# Altium project grad_board.PrjPcb
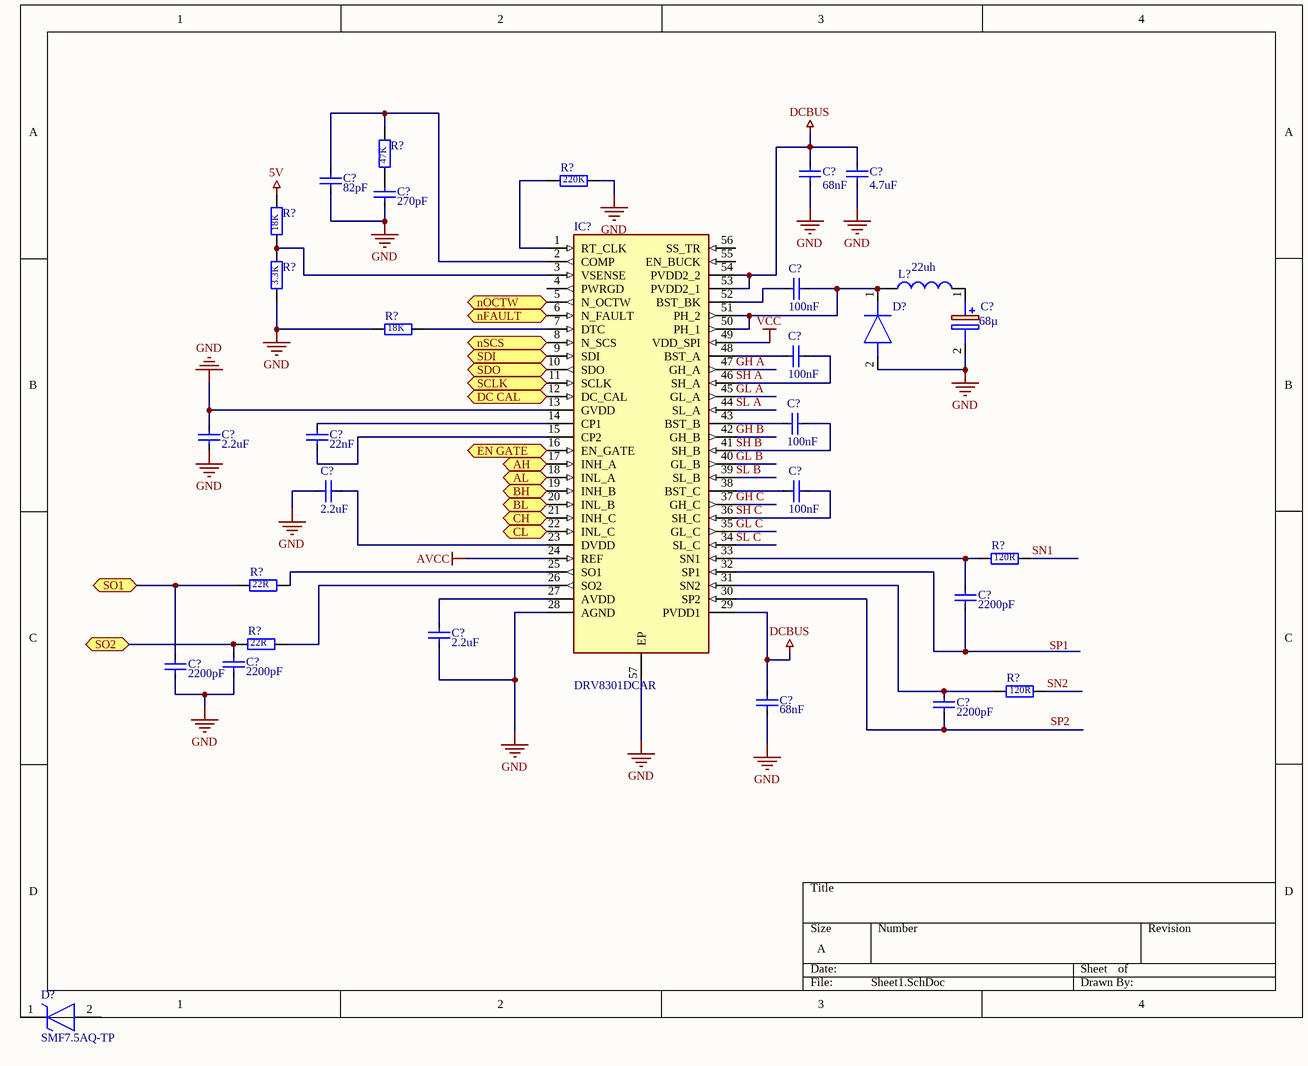
[diagram p0: Sheet1.SchDoc]
3 sheets, 127 parts. Net scope: flat (ports and power ports of the same name join across sheets).
Board file: PCB1.PcbDoc
Sheets:
  Sheet1.SchDoc
  Sheet2.SchDoc
  Sheet3.SchDoc

## Sheet Sheet1.SchDoc
size A

### Parts
(Parts that share a designator on the sheet are numbered #1, #2 ... from top to bottom, then left to right.)
C?#1  value 68nF  [CAPC1608X09N]  (hidden comment: C)
C?#2  value 4.7uF  [CAPC1608X09N]  (hidden comment: C)
C?#3  value 82pF  [CAPC1608X09N]  (hidden comment: C)
C?#4  value 270pF  [CAPC1608X09N]  (hidden comment: C)
C?#5  value 100nF  [CAPC1608X09N]  (hidden comment: C)
C?#6  value 68µ  [EEE1AA101SP]  (hidden comment: EEE-FN1E680P)
C?#7  value 100nF  [CAPC1608X09N]  (hidden comment: C)
C?#8  value 100nF  [CAPC1608X09N]  (hidden comment: C)
C?#9  value 2.2uF  [CAPC1608X09N]  (hidden comment: C)
C?#10  value 22nF  [CAPC1608X09N]  (hidden comment: C)
C?#11  value 2.2uF  [CAPC1608X09N]  (hidden comment: C)
C?#12  value 100nF  [CAPC1608X09N]  (hidden comment: C)
C?#13  value 2200pF  [CAPC1608X09N]  (hidden comment: C)
C?#14  value 2.2uF  [CAPC1608X09N]  (hidden comment: C)
C?#15  value 2200pF  [CAPC1608X09N]  (hidden comment: C)
C?#16  value 2200pF  [CAPC1608X09N]  (hidden comment: C)
C?#17  value 68nF  [CAPC1608X09N]  (hidden comment: C)
C?#18  value 2200pF  [CAPC1608X09N]  (hidden comment: C)
D?#1  MBR140SFT3G  [SODFL3616X98N]  (value not drawn)
D?#2  SMF7.5AQ-TP  [SMF75AQTP]
IC?#1  DRV8301DCAR  [SOP50P810X120-57N]
L?  value 22uh  [INDP6060X57N]  (hidden comment: L)
R?#1  value 47K  [RESC1608X06N]  (hidden comment: R)
R?#2  value 220K  [RESC1608X06N]  (hidden comment: R)
R?#3  value 18K  [RESC1608X06N]  (hidden comment: R)
R?#4  value 3.3K  [RESC1608X06N]  (hidden comment: R)
R?#5  value 18K  [RESC1608X06N]  (hidden comment: R)
R?#6  value 120R  [RESC1608X06N]  (hidden comment: R)
R?#7  value 22R  [RESC1608X06N]  (hidden comment: R)
R?#8  value 22R  [RESC1608X06N]  (hidden comment: R)
R?#9  value 120R  [RESC1608X06N]  (hidden comment: R)

### Ports
AH (bidir), AL (bidir), BH (bidir), BL (bidir), CH (bidir), CL (bidir), DC CAL (bidir), EN GATE (bidir), nFAULT (bidir), nOCTW (bidir), nSCS (bidir), SCLK (bidir), SDI (bidir), SDO (bidir), SO1 (bidir), SO2 (bidir)

### Nets
5V: R?#3.1
DCBUS: C?#1.1 C?#2.1 C?#17.2 IC?#1.29(PVDD1) IC?#1.53(PVDD2_1) IC?#1.54(PVDD2_2)
GND: C?#1.2 C?#2.2 C?#3.1 C?#4.1 C?#6.2(-) C?#9.1 C?#9.2 C?#11.1 C?#14.1 C?#15.1 C?#16.1 C?#17.1 D?#1.2(A) IC?#1.13(GVDD) IC?#1.28(AGND) IC?#1.57(EP) R?#2.2 R?#4.2 R?#5.1  [project net NRST]
VCC: IC?#1.49(VDD_SPI)
GH A: IC?#1.47(GH_A)
GH B: IC?#1.42(GH_B)
GH C: IC?#1.37(GH_C)
GL A: IC?#1.45(GL_A)
GL B: IC?#1.40(GL_B)
GL C: IC?#1.35(GL_C)
SH A: C?#7.2 IC?#1.46(SH_A)
SH B: C?#8.2 IC?#1.41(SH_B)
SH C: C?#12.2 IC?#1.36(SH_C)
SL A: IC?#1.44(SL_A)
SL B: IC?#1.39(SL_B)
SL C: IC?#1.34(SL_C)
SN1: R?#6.2
SN2: R?#9.2
NetC?#3_2: C?#3.2 IC?#1.2(COMP) R?#1.1
NetC?#4_2: C?#4.2 R?#1.2
NetC?#5_1: C?#5.1 IC?#1.52(BST_BK)
NetC?#5_2: C?#5.2 D?#1.1(K) IC?#1.50(PH_1) IC?#1.51(PH_2) L?.1
NetC?#6_1: C?#6.1(+) L?.2
NetC?#7_1: C?#7.1 IC?#1.48(BST_A)
NetC?#8_1: C?#8.1 IC?#1.43(BST_B)
NetC?#10_1: C?#10.1 IC?#1.15(CP2)
NetC?#10_2: C?#10.2 IC?#1.14(CP1)
NetC?#11_2: C?#11.2 IC?#1.23(DVDD)
NetC?#12_1: C?#12.1 IC?#1.38(BST_C)
NetC?#13_1: C?#13.1 IC?#1.32(SP1)
NetC?#13_2: C?#13.2 IC?#1.33(SN1) R?#6.1
NetC?#14_2: C?#14.2 IC?#1.27(AVDD)
NetC?#15_2: C?#15.2 R?#7.1 ; port SO1
NetC?#16_2: C?#16.2 R?#8.1 ; port SO2
NetC?#18_1: C?#18.1 IC?#1.30(SP2)
NetC?#18_2: C?#18.2 IC?#1.31(SN2) R?#9.1
NetIC?#1_1: IC?#1.1(RT_CLK) R?#2.1
NetIC?#1_3: IC?#1.3(VSENSE) R?#3.2 R?#4.1
NetIC?#1_5: IC?#1.5(N_OCTW) ; port nOCTW
NetIC?#1_6: IC?#1.6(N_FAULT) ; port nFAULT
NetIC?#1_7: IC?#1.7(DTC) R?#5.2
NetIC?#1_8: IC?#1.8(N_SCS) ; port nSCS
NetIC?#1_9: IC?#1.9(SDI) ; port SDI
NetIC?#1_10: IC?#1.10(SDO) ; port SDO
NetIC?#1_11: IC?#1.11(SCLK) ; port SCLK
NetIC?#1_12: IC?#1.12(DC_CAL) ; port DC CAL
NetIC?#1_16: IC?#1.16(EN_GATE) ; port EN GATE
NetIC?#1_17: IC?#1.17(INH_A) ; port AH
NetIC?#1_18: IC?#1.18(INL_A) ; port AL
NetIC?#1_19: IC?#1.19(INH_B) ; port BH
NetIC?#1_20: IC?#1.20(INL_B) ; port BL
NetIC?#1_21: IC?#1.21(INH_C) ; port CH
NetIC?#1_22: IC?#1.22(INL_C) ; port CL
NetIC?#1_25: IC?#1.25(SO1) R?#7.2
NetIC?#1_26: IC?#1.26(SO2) R?#8.2

Not connected (* = marked no-connect by the designer): D?#2 1(K) 2(A); IC?#1 4(PWRGD) 24(REF) 55(EN_BUCK) 56(SS_TR)

### Notes on the sheet
- Labels drawn without touching a wire or pin: AVCC, SP1, SP2

### Library data of the parts
C?#1 C?#17 = C: MPN: CC0603KRX7R8BB683; Link: https://www.lcsc.com/product-detail/Multilayer-Ceramic-Capacitors-MLCC-SMD-SMT_YAGEO-CC0603KRX7R8BB683_C107071.html
C?#2 = C: MPN: GRM188C81E475KE11D; Link: https://www.lcsc.com/product-detail/Multilayer-Ceramic-Capacitors-MLCC-SMD-SMT_Murata-Electronics-GRM188C81E475KE11D_C417145.html
C?#3 = C: MPN: CC0603JRNPO9BN820; Link: https://www.lcsc.com/product-detail/Multilayer-Ceramic-Capacitors-MLCC-SMD-SMT_YAGEO-CC0603JRNPO9BN820_C107056.html
C?#4 = C: MPN: 0603B271K500NT; Link: https://www.lcsc.com/product-detail/Multilayer-Ceramic-Capacitors-MLCC-SMD-SMT_YAGEO-CC0603JRNPO9BN271_C107046.html
C?#5 C?#7 C?#8 C?#12 = C: MPN: 06033C104KAT4A; Link: https://www.lcsc.com/product-detail/Multilayer-Ceramic-Capacitors-MLCC-SMD-SMT_Kyocera-AVX-06033C104KAT4A_C2167104.html
C?#6 = EEE-FN1E680P: Capacitor Polarised; Manufacturer_Name: Panasonic; Datasheet Link: http://industrial.panasonic.com/cdbs/www-data/pdf/RDE0000/RDE0000C1259.pdf; Height: 7.8mm; Manufacturer_Part_Number: EEE-FN1E680P; Mouser Part Number: 667-EEE-FN1E680P; Mouser Price/Stock: https://www.mouser.co.uk/ProductDetail/Panasonic/EEE-FN1E680P?qs=OlC7AqGiEDlbbbPxcb4suw%3D%3D; Arrow Part Number: EEE-FN1E680P; Arrow Price/Stock: https://www.arrow.com/en/products/eee-fn1e680p/panasonic
C?#9 C?#11 C?#14 = C: MPN: 0603B225K250NT; Link: https://www.lcsc.com/product-detail/Multilayer-Ceramic-Capacitors-MLCC-SMD-SMT_FH-Guangdong-Fenghua-Advanced-Tech-0603B225K250NT_C99228.html
C?#10 = C: MPN: CC0603KRX7R8BB223; Link: https://www.lcsc.com/product-detail/Multilayer-Ceramic-Capacitors-MLCC-SMD-SMT_YAGEO-CC0603KRX7R8BB223_C106217.html
C?#13 C?#15 C?#16 C?#18 = C: MPN: CC0603KRX7R8BB222; Link: https://www.lcsc.com/product-detail/Multilayer-Ceramic-Capacitors-MLCC-SMD-SMT_YAGEO-CC0603KRX7R8BB222_C519422.html
D?#1 = MBR140SFT3G: Diode; Manufacturer_Name: onsemi; Datasheet Link: https://componentsearchengine.com/Datasheets/2/MBR140SFT3G.pdf; Height: 0.98mm; Manufacturer_Part_Number: MBR140SFT3G; Mouser Part Number: 863-MBR140SFT3G; Mouser Price/Stock: https://www.mouser.co.uk/ProductDetail/onsemi/MBR140SFT3G?qs=3JMERSakebocVlQyvh5H6Q%3D%3D; Arrow Part Number: MBR140SFT3G; Arrow Price/Stock: https://www.arrow.com/en/products/mbr140sft3g/on-semiconductor?region=nac
D?#2 = SMF7.5AQ-TP: TVS Diode (Uni-directional); Manufacturer_Name: MCC; Datasheet Link: https://mccsemi.com/pdf/Products/SMF5.0AQ_SMF100AQ(SOD-123FL).pdf; Height: 1.35mm; Manufacturer_Part_Number: SMF7.5AQ-TP
IC?#1 = DRV8301DCAR: Integrated Circuit; Manufacturer_Name: Texas Instruments; Datasheet Link: http://www.ti.com/lit/gpn/drv8301; Height: 1.2mm; Manufacturer_Part_Number: DRV8301DCAR; Mouser Part Number: 595-DRV8301DCAR; Mouser Price/Stock: https://www.mouser.co.uk/ProductDetail/Texas-Instruments/DRV8301DCAR?qs=SMj%252Bbyv09TwYHebRFanjcw%3D%3D; Arrow Part Number: DRV8301DCAR; Arrow Price/Stock: null?region=nac
L? = L: MPN: XRNR6028-22uH/M; Link: https://www.lcsc.com/product-detail/Power-Inductors_XR-XRNR6028-22uH-M_C5339730.html
R?#1 = R: MPN: FRC0603F4702TS; Link: https://www.lcsc.com/product-detail/Chip-Resistor-Surface-Mount_FOJAN-FRC0603F4702TS_C2907042.html
R?#2 = R: MPN: ARG03FTC2203; Link: https://www.lcsc.com/product-detail/Chip-Resistor-Surface-Mount_Viking-Tech-ARG03FTC2203_C217882.html
R?#3 R?#5 = R: MPN: 0603WAF1802T5E; Link: https://www.lcsc.com/product-detail/Chip-Resistor-Surface-Mount_UNI-ROYAL-Uniroyal-Elec-0603WAF1802T5E_C25810.html
R?#4 = R: MPN: RC0603FR-073K3L; Link: https://www.lcsc.com/product-detail/Chip-Resistor-Surface-Mount_YAGEO-RC0603FR-073K3L_C108078.html
R?#6 R?#9 = R: MPN: ARG03FTC1200; Link: https://www.lcsc.com/product-detail/Chip-Resistor-Surface-Mount_Viking-Tech-ARG03FTC1200_C217712.html
R?#7 R?#8 = R: MPN: ARG03FTC0220; Link: https://www.lcsc.com/product-detail/Chip-Resistor-Surface-Mount_Viking-Tech-ARG03FTC0220_C217888.html

## Sheet Sheet2.SchDoc
size A2
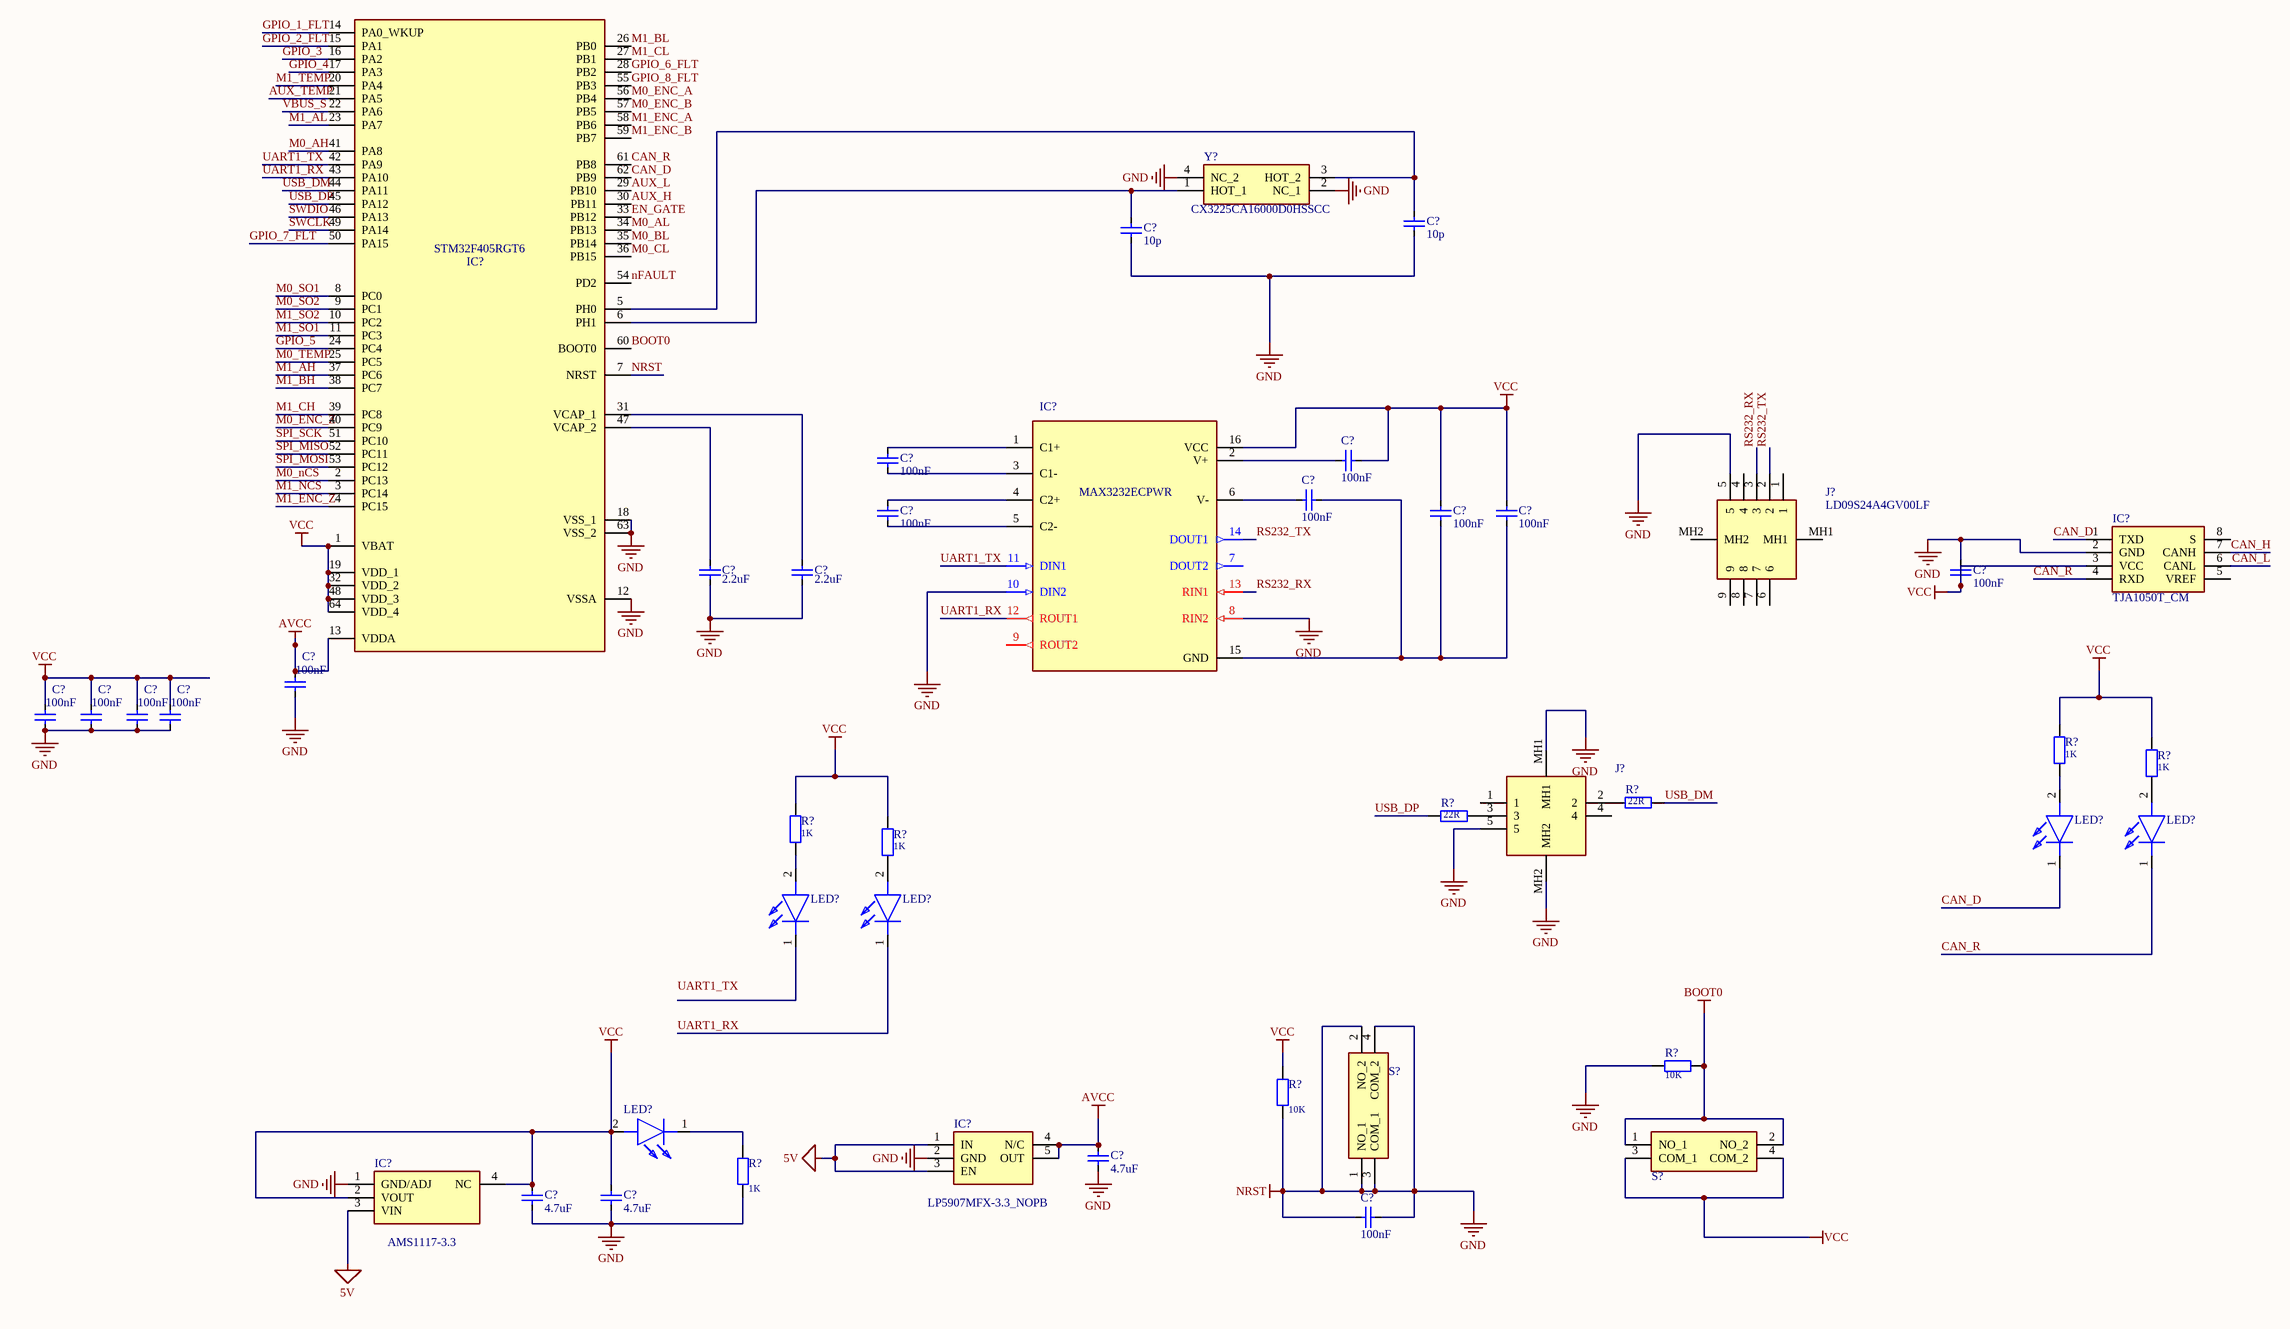
[diagram p1: Sheet2.SchDoc]

### Parts
(Parts that share a designator on the sheet are numbered #1, #2 ... from top to bottom, then left to right.)
C?#19  value 10p  [CAPC1005X06N]  (hidden comment: C)
C?#20  value 10p  [CAPC1005X06N]  (hidden comment: C)
C?#21  value 100nF  [CAPC1608X09N]  (hidden comment: C)
C?#22  value 100nF  [CAPC1608X09N]  (hidden comment: C)
C?#23  value 100nF  [CAPC1608X09N]  (hidden comment: C)
C?#24  value 100nF  [CAPC1608X09N]  (hidden comment: C)
C?#25  value 100nF  [CAPC1608X09N]  (hidden comment: C)
C?#26  value 100nF  [CAPC1608X09N]  (hidden comment: C)
C?#27  value 2.2uF  [CAPC1608X09N]  (hidden comment: C)
C?#28  value 2.2uF  [CAPC1608X09N]  (hidden comment: C)
C?#29  value 100nF  [CAPC1608X09N]  (hidden comment: C)
C?#30  value 100nF  [CAPC1005X06N]  (hidden comment: C)
C?#31  value 100nF  [CAPC1005X06N]  (hidden comment: C)
C?#32  value 100nF  [CAPC1005X06N]  (hidden comment: C)
C?#33  value 100nF  [CAPC1005X06N]  (hidden comment: C)
C?#34  value 100nF  [CAPC1005X06N]  (hidden comment: C)
C?#35  value 4.7uF  [CAPC1608X09N]  (hidden comment: C)
C?#36  value 4.7uF  [CAPC1608X09N]  (hidden comment: C)
C?#37  value 4.7uF  [CAPC1608X09N]  (hidden comment: C)
C?#38  value 100nF  [CAPC1608X09N]  (hidden comment: C)
IC?#2  STM32F405RGT6  [QFP50P1200X1200X160-64N]
IC?#3  MAX3232ECPWR  [SOP65P640X120-16N]
IC?#4  TJA1050T_CM  [SOIC127P600X175-8N]
IC?#5  LP5907MFX-3.3_NOPB  [SOT95P280X145-5N]
IC?#6  AMS1117-3.3  [SOT229P700X180-4N]
J?#1  LD09S24A4GV00LF  [LD09S24A4GV00LF]
J?#2  10119313-301TLF  [10119313301TLF]  (value not drawn)
LED?#1  LTST-C190KGKT  [LEDC1608X80N]  (value not drawn)
LED?#2  LTST-C190KGKT  [LEDC1608X80N]  (value not drawn)
LED?#3  LTST-C190KGKT  [LEDC1608X80N]  (value not drawn)
LED?#4  LTST-C190KGKT  [LEDC1608X80N]  (value not drawn)
LED?#5  LTST-C190KGKT  [LEDC1608X80N]  (value not drawn)
R?#10  value 1K  [RESC1608X06N]  (hidden comment: R)
R?#11  value 1K  [RESC1608X06N]  (hidden comment: R)
R?#12  value 22R  [RESC1608X06N]  (hidden comment: R)
R?#13  value 22R  [RESC1608X06N]  (hidden comment: R)
R?#14  value 1K  [RESC1608X06N]  (hidden comment: R)
R?#15  value 1K  [RESC1608X06N]  (hidden comment: R)
R?#16  value 10K  [RESC1005X04N]  (hidden comment: R)
R?#17  value 10K  [RESC1005X04N]  (hidden comment: R)
R?#18  value 1K  [RESC1005X04N]  (hidden comment: R)
S?#1  TS18-5-25-SL-260-SMT-TR  [TS18525SL260SMTTR]  (value not drawn)
S?#2  TS18-5-25-SL-260-SMT-TR  [TS18525SL260SMTTR]  (value not drawn)
Y?  CX3225CA16000D0HSSCC  [CX3225CA16000D0HSSCC]

### Nets
5V: IC?#5.1(IN) IC?#5.3(EN) IC?#6.3(VIN)
AVCC: C?#30.2 C?#35.1 IC?#2.13(VDDA) IC?#5.4(N/C) IC?#5.5(OUT)
BOOT0: IC?#2.60(BOOT0) R?#16.2 S?#1.1(NO_1) S?#1.2(NO_2)
NRST: C?#19.2 C?#20.2 C?#27.1 C?#28.1 C?#29.2 C?#30.1 C?#31.1 C?#32.1 C?#33.1 C?#34.1 C?#35.2 C?#36.2 C?#37.2 C?#38.1 C?#38.2 IC?#2.7(NRST) IC?#2.12(VSSA) IC?#2.18(VSS_1) IC?#2.63(VSS_2) IC?#3.8(RIN2) IC?#3.10(DIN2) IC?#4.2(GND) IC?#5.2(GND) IC?#6.1(GND/ADJ) J?#1.5 J?#2.5 J?#2.MH1 J?#2.MH2 R?#16.1 R?#17.2 R?#18.1 S?#2.1(NO_1) S?#2.2(NO_2) S?#2.3(COM_1) S?#2.4(COM_2) Y?.2(NC_1) Y?.4(NC_2)  [also labelled GND]
VCC: C?#21.2 C?#25.2 C?#26.2 C?#29.1 C?#31.2 C?#32.2 C?#33.2 C?#34.2 C?#36.1 C?#37.1 IC?#2.1(VBAT) IC?#2.19(VDD_1) IC?#2.32(VDD_2) IC?#2.48(VDD_3) IC?#2.64(VDD_4) IC?#3.16(VCC) IC?#4.3(VCC) IC?#6.2(VOUT) IC?#6.4(NC) LED?#5.2(A) R?#10.1 R?#11.1 R?#14.1 R?#15.1 R?#17.1 S?#1.3(COM_1) S?#1.4(COM_2)
AUX_H: IC?#2.30(PB11)
AUX_L: IC?#2.29(PB10)
AUX_TEMP: IC?#2.21(PA5)
CAN_D: IC?#2.62(PB9) IC?#4.1(TXD) LED?#1.1(K)
CAN_H: IC?#4.7(CANH)
CAN_L: IC?#4.6(CANL)
CAN_R: IC?#2.61(PB8) IC?#4.4(RXD) LED?#2.1(K)
EN_GATE: IC?#2.33(PB12)
GPIO_1_FLT: IC?#2.14(PA0_WKUP)
GPIO_2_FLT: IC?#2.15(PA1)
GPIO_3: IC?#2.16(PA2)
GPIO_4: IC?#2.17(PA3)
GPIO_5: IC?#2.24(PC4)
GPIO_6_FLT: IC?#2.28(PB2)
GPIO_7_FLT: IC?#2.50(PA15)
GPIO_8_FLT: IC?#2.55(PB3)
M0_AH: IC?#2.41(PA8)
M0_AL: IC?#2.34(PB13)
M0_BL: IC?#2.35(PB14)
M0_CL: IC?#2.36(PB15)
M0_ENC_A: IC?#2.56(PB4)
M0_ENC_B: IC?#2.57(PB5)
M0_ENC_Z: IC?#2.40(PC9)
M0_nCS: IC?#2.2(PC13)
M0_SO1: IC?#2.8(PC0)
M0_SO2: IC?#2.9(PC1)
M0_TEMP: IC?#2.25(PC5)
M1_AH: IC?#2.37(PC6)
M1_AL: IC?#2.23(PA7)
M1_BH: IC?#2.38(PC7)
M1_BL: IC?#2.26(PB0)
M1_CH: IC?#2.39(PC8)
M1_CL: IC?#2.27(PB1)
M1_ENC_A: IC?#2.58(PB6)
M1_ENC_B: IC?#2.59(PB7)
M1_ENC_Z: IC?#2.4(PC15)
M1_NCS: IC?#2.3(PC14)
M1_SO1: IC?#2.11(PC3)
M1_SO2: IC?#2.10(PC2)
M1_TEMP: IC?#2.20(PA4)
nFAULT: IC?#2.54(PD2)
RS232_RX: IC?#3.13(RIN1) J?#1.3
RS232_TX: IC?#3.14(DOUT1) J?#1.2
SPI_MISO: IC?#2.52(PC11)
SPI_MOSI: IC?#2.53(PC12)
SPI_SCK: IC?#2.51(PC10)
SWCLK: IC?#2.49(PA14)
SWDIO: IC?#2.46(PA13)
UART1_RX: IC?#2.43(PA10) IC?#3.12(ROUT1) LED?#4.1(K)
UART1_TX: IC?#2.42(PA9) IC?#3.11(DIN1)
USB_DM: IC?#2.44(PA11) R?#12.2
USB_DP: IC?#2.45(PA12) R?#13.1
VBUS_S: IC?#2.22(PA6)
NetC?#19_1: C?#19.1 IC?#2.5(PH0) Y?.3(HOT_2)
NetC?#20_1: C?#20.1 IC?#2.6(PH1) Y?.1(HOT_1)
NetC?#21_1: C?#21.1 IC?#3.2(V+)
NetC?#22_1: C?#22.1 IC?#3.3(C1-)
NetC?#22_2: C?#22.2 IC?#3.1(C1+)
NetC?#23_1: C?#23.1 C?#25.1 C?#26.1 IC?#3.15(GND)
NetC?#23_2: C?#23.2 IC?#3.6(V-)
NetC?#24_1: C?#24.1 IC?#3.5(C2-)
NetC?#24_2: C?#24.2 IC?#3.4(C2+)
NetC?#27_2: C?#27.2 IC?#2.47(VCAP_2)
NetC?#28_2: C?#28.2 IC?#2.31(VCAP_1)
NetJ?#2_2: J?#2.2 R?#12.1
NetJ?#2_3: J?#2.3 R?#13.2
NetLED?#1_2: LED?#1.2(A) R?#10.2
NetLED?#2_2: LED?#2.2(A) R?#11.2
NetLED?#3_2: LED?#3.2(A) R?#14.2
NetLED?#4_2: LED?#4.2(A) R?#15.2
NetLED?#5_1: LED?#5.1(K) R?#18.2

Not connected (* = marked no-connect by the designer): IC?#3 7(DOUT2) 9(ROUT2); IC?#4 5(VREF) 8(S); J?#1 1 4 6 7 8 9 MH1 MH2; J?#2 1 4; LED?#3 1(K)

### Notes on the sheet
- Labels drawn without touching a wire or pin: UART1_TX
- Title
- Size:
- Date:
- File:
- A2
- Number:
- Time:
- Revision:
- Sheet
- of

### Library data of the parts
C?#19 C?#20 = C: MPN: 0603CG100J250NT; Link: https://www.lcsc.com/product-detail/Multilayer-Ceramic-Capacitors-MLCC-SMD-SMT_FH-Guangdong-Fenghua-Advanced-Tech-0603CG100J250NT_C2939806.html
C?#21-C?#26 C?#29-C?#34 C?#38 = C: MPN: 06033C104KAT4A; Link: https://www.lcsc.com/product-detail/Multilayer-Ceramic-Capacitors-MLCC-SMD-SMT_Kyocera-AVX-06033C104KAT4A_C2167104.html
C?#27 C?#28 = C: MPN: 0603B225K250NT; Link: https://www.lcsc.com/product-detail/Multilayer-Ceramic-Capacitors-MLCC-SMD-SMT_FH-Guangdong-Fenghua-Advanced-Tech-0603B225K250NT_C99228.html
C?#35-C?#37 = C: MPN: GRM188C81E475KE11D; Link: https://www.lcsc.com/product-detail/Multilayer-Ceramic-Capacitors-MLCC-SMD-SMT_Murata-Electronics-GRM188C81E475KE11D_C417145.html
IC?#2 = STM32F405RGT6: Integrated Circuit; Manufacturer_Name: STMicroelectronics; Datasheet Link: http://www.st.com/web/en/resource/technical/document/datasheet/DM00037051.pdf; Height: 1.6mm; Manufacturer_Part_Number: STM32F405RGT6; Mouser Part Number: 511-STM32F405RGT6; Mouser Price/Stock: https://www.mouser.co.uk/ProductDetail/STMicroelectronics/STM32F405RGT6?qs=Z8%252BeY1k3TIKgj7QWsYGpQw%3D%3D; Arrow Part Number: STM32F405RGT6; Arrow Price/Stock: https://www.arrow.com/en/products/stm32f405rgt6/stmicroelectronics?utm_currency=USD&region=nac
IC?#3 = MAX3232ECPWR: Integrated Circuit; Manufacturer_Name: Texas Instruments; Datasheet Link: http://www.ti.com/general/docs/lit/getliterature.tsp?genericPartNumber=MAX3232E&fileType=pdf&HQS=ti-null-null-sf-df-pf-sep-wwe&DCM=yes; Height: 1.2mm; Manufacturer_Part_Number: MAX3232ECPWR; Mouser Part Number: 595-MAX3232ECPWR; Mouser Price/Stock: https://www.mouser.co.uk/ProductDetail/Texas-Instruments/MAX3232ECPWR?qs=paYhMW8qfis8NsHohmO7ng%3D%3D; Arrow Part Number: MAX3232ECPWR; Arrow Price/Stock: https://www.arrow.com/en/products/max3232ecpwr/texas-instruments?region=nac
IC?#4 = TJA1050T_CM: Integrated Circuit; Manufacturer_Name: NXP; Manufacturer_Part_Number: XL1050; Datasheet Link: https://www.tme.eu/Document/977d0fd8449c416da25cef30c4f64641/TJA1050.pdf; Height: 1.75mm; Mouser Part Number: N/A; Mouser Price/Stock: https://www.mouser.co.uk/ProductDetail/NXP-Semiconductors/TJA1050T-CM?qs=fAHHVMwC%252BbibiWs27gP5ng%3D%3D; link: https://www.lcsc.com/product-detail/CAN-Transceivers_XINLUDA-XL1050_C609746.html
IC?#5 = LP5907MFX-3.3_NOPB: Integrated Circuit; Manufacturer_Name: Texas Instruments; Manufacturer_Part_Number: LP5907MFX-3.3/NOPB; Datasheet Link: https://datasheet.datasheetarchive.com/originals/distributors/Datasheets-SFU2/DSASFU100037200.pdf; Height: 1.45mm; Mouser Part Number: 595-LP5907MFX-3.3NPB; Mouser Price/Stock: https://www.mouser.co.uk/ProductDetail/Texas-Instruments/LP5907MFX-3.3-NOPB?qs=biyDIajrTn6NhrJCoL%2FdSQ%3D%3D; Arrow Part Number: LP5907MFX-3.3/NOPB; Arrow Price/Stock: https://www.arrow.com/en/products/lp5907mfx-3.3nopb/texas-instruments?utm_currency=USD&region=nac
IC?#6 = AMS1117-3.3: Integrated Circuit; Manufacturer_Name: Advanced; Datasheet Link: https://datasheet.datasheetarchive.com/originals/distributors/Datasheets-28/DSA-550594.pdf; Height: 1.8mm; Manufacturer_Part_Number: AMS1117-3.3
J?#1 = LD09S24A4GV00LF: Connector; Manufacturer_Name: Amphenol Communications Solutions; Datasheet Link: https://cdn.amphenol-cs.com/media/wysiwyg/files/drawing/10130912.pdf; Height: 12.39mm; Manufacturer_Part_Number: LD09S24A4GV00LF; Arrow Part Number: LD09S24A4GV00LF; Arrow Price/Stock: https://www.arrow.com/en/products/ld09s24a4gv00lf/amphenol-fci?utm_currency=USD&region=nac
J?#2 = 10119313-301TLF: Connector; Manufacturer_Name: Amphenol; Manufacturer_Part_Number: HX MINI5P T; Datasheet Link: https://cdn.amphenol-cs.com/media/wysiwyg/files/drawing/10119313.pdf; Height: 9.7mm; Mouser Part Number: 649-10119313-301TLF; Mouser Price/Stock: https://www.mouser.co.uk/ProductDetail/Amphenol-FCI/10119313-301TLF?qs=QcFhgjUTvvrAeUuachPUXg%3D%3D; link: https://www.lcsc.com/product-detail/USB-Connectors_hanxia-HX-MINI5P-T_C19189146.html
LED?#1 LED?#3 = LTST-C190KGKT: LED; Manufacturer_Name: Lite-On; Manufacturer_Part_Number: XL-1608UBC-04; Datasheet Link: http://uk.rs-online.com/web/p/visible-leds/6920988/; Height: 0.8mm; Mouser Part Number: 859-LTST-C190KGKT; Mouser Price/Stock: https://www.mouser.co.uk/ProductDetail/Lite-On/LTST-C190KGKT?qs=205qCy6M2Q%252BAdcgwUZktqw%3D%3D; Arrow Part Number: LTST-C190KGKT; Arrow Price/Stock: https://www.arrow.com/en/products/ltst-c190kgkt/lite-on-technology?region=europe
LED?#2 LED?#4 = LTST-C190KGKT: LED; Manufacturer_Name: Lite-On; Manufacturer_Part_Number: XL-1608PGC-06; Datasheet Link: http://uk.rs-online.com/web/p/visible-leds/6920988/; Height: 0.8mm; Mouser Part Number: 859-LTST-C190KGKT; Mouser Price/Stock: https://www.mouser.co.uk/ProductDetail/Lite-On/LTST-C190KGKT?qs=205qCy6M2Q%252BAdcgwUZktqw%3D%3D; Arrow Part Number: LTST-C190KGKT; Arrow Price/Stock: https://www.arrow.com/en/products/ltst-c190kgkt/lite-on-technology?region=europe
LED?#5 = LTST-C190KGKT: LED; Manufacturer_Name: Lite-On; Datasheet Link: http://uk.rs-online.com/web/p/visible-leds/6920988/; Height: 0.8mm; Manufacturer_Part_Number: LTST-C190KGKT; Mouser Part Number: 859-LTST-C190KGKT; Mouser Price/Stock: https://www.mouser.co.uk/ProductDetail/Lite-On/LTST-C190KGKT?qs=205qCy6M2Q%252BAdcgwUZktqw%3D%3D; Arrow Part Number: LTST-C190KGKT; Arrow Price/Stock: https://www.arrow.com/en/products/ltst-c190kgkt/lite-on-technology?region=europe
R?#12 R?#13 = R: MPN: ARG03FTC0220; Link: https://www.lcsc.com/product-detail/Chip-Resistor-Surface-Mount_Viking-Tech-ARG03FTC0220_C217888.html
R?#16 R?#17 = R: MPN: RC0603FR-0710KL; Link: https://www.lcsc.com/product-detail/Chip-Resistor-Surface-Mount_YAGEO-RC0603FR-0710KL_C98220.html
S?#1 S?#2 = TS18-5-25-SL-260-SMT-TR: Switch; Manufacturer_Name: Same Sky; Datasheet Link: https://www.cuidevices.com/product/resource/ts18.pdf; Height: 2.7mm; Manufacturer_Part_Number: TS18-5-25-SL-260-SMT-TR; Mouser Part Number: 179-TS18525SL260SMTT; Mouser Price/Stock: https://www.mouser.co.uk/ProductDetail/Same-Sky/TS18-5-25-SL-260-SMT-TR?qs=tlsG%2FOw5FFh0yS4gYnfcwg%3D%3D
Y? = CX3225CA16000D0HSSCC: Crystal or Oscillator; Manufacturer_Name: Kyocera AVX; MPN: TAXM8M4RDBCCT2T; Datasheet Link: https://media.digikey.com/pdf/Data%20Sheets/AVX%20PDFs/CX3225CA_%20Series_Spec.pdf; Height: 0.9mm; Manufacturer_Part_Number: CX3225CA16000D0HSSCC; Mouser Part Number: N/A; Mouser Price/Stock: https://www.mouser.co.uk/ProductDetail/Kyocera-Electronic-Components/CX3225CA16000D0HSSCC?qs=A6eO%252BMLsxmRcoOtVnFyCOA%3D%3D; Arrow Part Number: CX3225CA16000D0HSSCC; Arrow Price/Stock: https://www.arrow.com/en/products/cx3225ca16000d0hsscc/kyocera; LINK: https://www.lcsc.com/product-detail/Crystals_Yajingxin-TAXM8M4RDBCCT2T_C400090.html
R?#10 R?#11 R?#14 R?#15 R?#18 = R
  R?#18: MPN: *; Link: *

## Sheet Sheet3.SchDoc
size A2
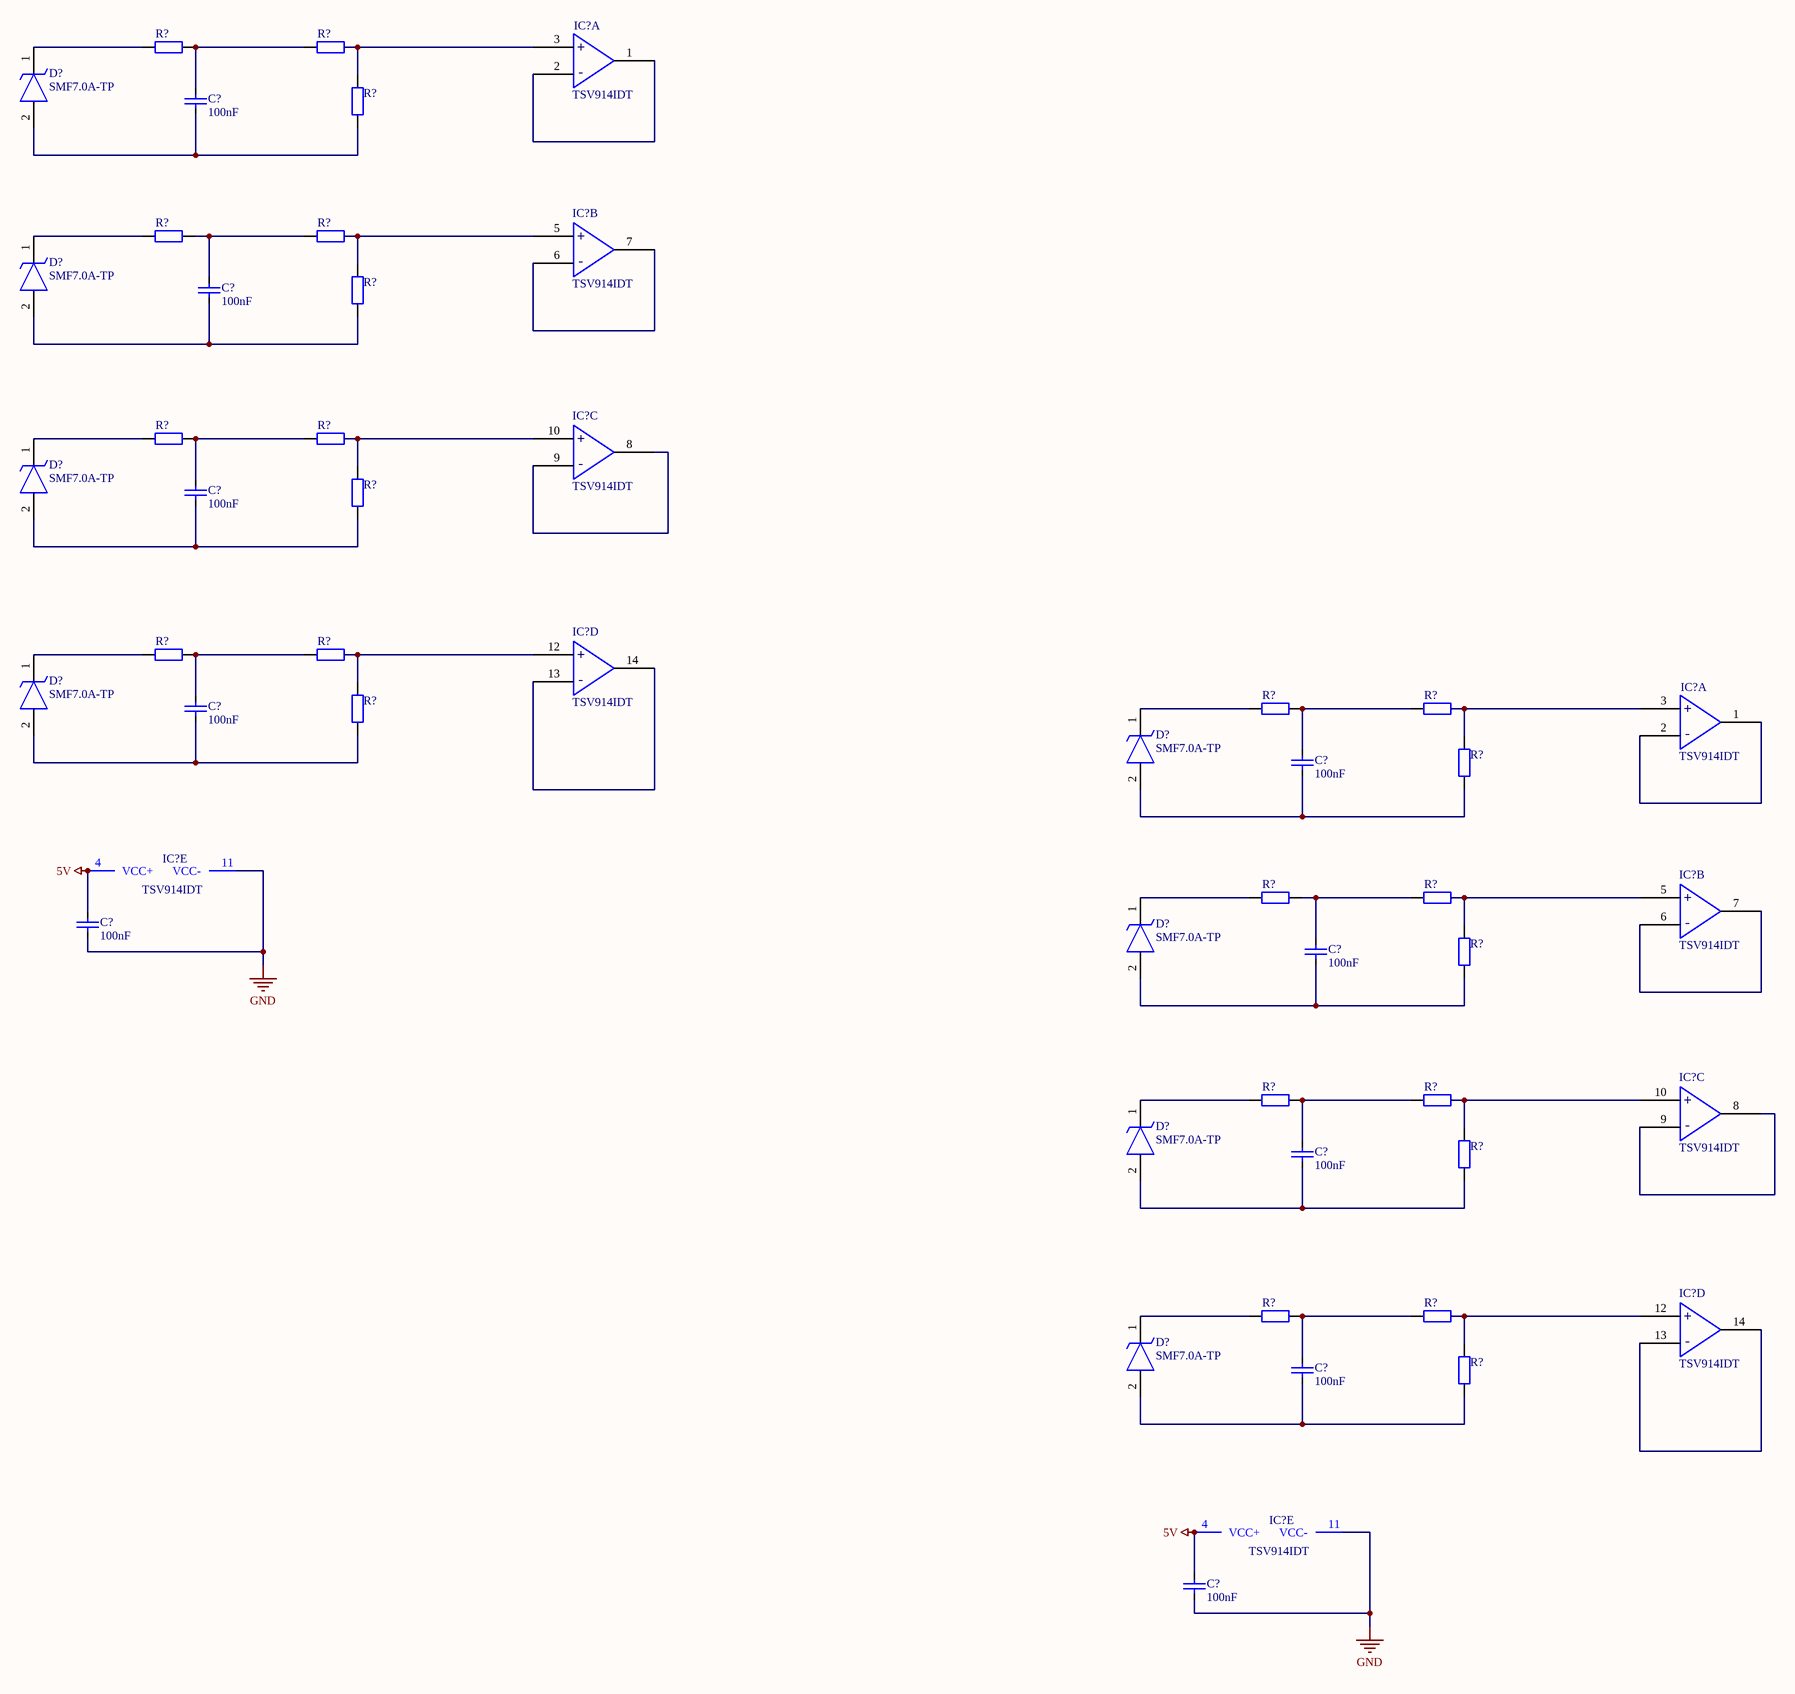
[diagram p2: Sheet3.SchDoc]

### Parts
(Parts that share a designator on the sheet are numbered #1, #2 ... from top to bottom, then left to right.)
C?#39  value 100nF  [CAPC1608X09N]  (hidden comment: C)
C?#40  value 100nF  [CAPC1608X09N]  (hidden comment: C)
C?#41  value 100nF  [CAPC1608X09N]  (hidden comment: C)
C?#42  value 100nF  [CAPC1608X09N]  (hidden comment: C)
C?#43  value 100nF  [CAPC1608X09N]  (hidden comment: C)
C?#44  value 100nF  [CAPC1608X09N]  (hidden comment: C)
C?#45  value 100nF  [CAPC1608X09N]  (hidden comment: C)
C?#46  value 100nF  [CAPC1608X09N]  (hidden comment: C)
C?#47  value 100nF  [CAPC1608X09N]  (hidden comment: C)
C?#48  value 100nF  [CAPC1608X09N]  (hidden comment: C)
D?#3  SMF7.0A-TP  [SMF70ATP]
D?#4  SMF7.0A-TP  [SMF70ATP]
D?#5  SMF7.0A-TP  [SMF70ATP]
D?#6  SMF7.0A-TP  [SMF70ATP]
D?#7  SMF7.0A-TP  [SMF70ATP]
D?#8  SMF7.0A-TP  [SMF70ATP]
D?#9  SMF7.0A-TP  [SMF70ATP]
D?#10  SMF7.0A-TP  [SMF70ATP]
IC?#7  TSV914IDT  [SOIC127P600X175-14N]  (part A of 5)
IC?#8  TSV914IDT  [SOIC127P600X175-14N]  (part B of 5)
IC?#9  TSV914IDT  [SOIC127P600X175-14N]  (part C of 5)
IC?#10  TSV914IDT  [SOIC127P600X175-14N]  (part D of 5)
IC?#11  TSV914IDT  [SOIC127P600X175-14N]  (part A of 5)
IC?#12  TSV914IDT  [SOIC127P600X175-14N]  (part E of 5)
IC?#13  TSV914IDT  [SOIC127P600X175-14N]  (part B of 5)
IC?#14  TSV914IDT  [SOIC127P600X175-14N]  (part C of 5)
IC?#15  TSV914IDT  [SOIC127P600X175-14N]  (part D of 5)
IC?#16  TSV914IDT  [SOIC127P600X175-14N]  (part E of 5)
R?#19  R  [RESC1608X06N]  (value not drawn)
R?#20  R  [RESC1608X06N]  (value not drawn)
R?#21  R  [RESC1608X06N]  (value not drawn)
R?#22  R  [RESC1608X06N]  (value not drawn)
R?#23  R  [RESC1608X06N]  (value not drawn)
R?#24  R  [RESC1608X06N]  (value not drawn)
R?#25  R  [RESC1608X06N]  (value not drawn)
R?#26  R  [RESC1608X06N]  (value not drawn)
R?#27  R  [RESC1608X06N]  (value not drawn)
R?#28  R  [RESC1608X06N]  (value not drawn)
R?#29  R  [RESC1608X06N]  (value not drawn)
R?#30  R  [RESC1608X06N]  (value not drawn)
R?#31  R  [RESC1608X06N]  (value not drawn)
R?#32  R  [RESC1608X06N]  (value not drawn)
R?#33  R  [RESC1608X06N]  (value not drawn)
R?#34  R  [RESC1608X06N]  (value not drawn)
R?#35  R  [RESC1608X06N]  (value not drawn)
R?#36  R  [RESC1608X06N]  (value not drawn)
R?#37  R  [RESC1608X06N]  (value not drawn)
R?#38  R  [RESC1608X06N]  (value not drawn)
R?#39  R  [RESC1608X06N]  (value not drawn)
R?#40  R  [RESC1608X06N]  (value not drawn)
R?#41  R  [RESC1608X06N]  (value not drawn)
R?#42  R  [RESC1608X06N]  (value not drawn)

### Nets
5V: C?#44.2 C?#48.2 IC?#12.4(VCC+) IC?#16.4(VCC+)
GND: C?#44.1 C?#48.1 IC?#12.11(VCC-) IC?#16.11(VCC-)  [project net NRST]
NetC?#39_1: C?#39.1 D?#3.2(A) R?#21.1
NetC?#39_2: C?#39.2 R?#19.1 R?#20.1
NetC?#40_1: C?#40.1 D?#4.2(A) R?#24.1
NetC?#40_2: C?#40.2 R?#22.1 R?#23.1
NetC?#41_1: C?#41.1 D?#5.2(A) R?#27.1
NetC?#41_2: C?#41.2 R?#25.1 R?#26.1
NetC?#42_1: C?#42.1 D?#6.2(A) R?#30.1
NetC?#42_2: C?#42.2 R?#28.1 R?#29.1
NetC?#43_1: C?#43.1 D?#7.2(A) R?#33.1
NetC?#43_2: C?#43.2 R?#31.1 R?#32.1
NetC?#45_1: C?#45.1 D?#8.2(A) R?#36.1
NetC?#45_2: C?#45.2 R?#34.1 R?#35.1
NetC?#46_1: C?#46.1 D?#9.2(A) R?#39.1
NetC?#46_2: C?#46.2 R?#37.1 R?#38.1
NetC?#47_1: C?#47.1 D?#10.2(A) R?#42.1
NetC?#47_2: C?#47.2 R?#40.1 R?#41.1
NetD?#3_1: D?#3.1(K) R?#19.2
NetD?#4_1: D?#4.1(K) R?#22.2
NetD?#5_1: D?#5.1(K) R?#25.2
NetD?#6_1: D?#6.1(K) R?#28.2
NetD?#7_1: D?#7.1(K) R?#31.2
NetD?#8_1: D?#8.1(K) R?#34.2
NetD?#9_1: D?#9.1(K) R?#37.2
NetD?#10_1: D?#10.1(K) R?#40.2
NetIC?#7_1: IC?#7.1(OUTA) IC?#7.2(IN-A)
NetIC?#7_3: IC?#7.3(In+A) R?#20.2 R?#21.2
NetIC?#8_5: IC?#8.5(In+B) R?#23.2 R?#24.2
NetIC?#8_6: IC?#8.6(IN-B) IC?#8.7(OUTB)
NetIC?#9_8: IC?#9.8(OUTC) IC?#9.9(IN-C)
NetIC?#9_10: IC?#9.10(In+C) R?#26.2 R?#27.2
NetIC?#10_12: IC?#10.12(In+D) R?#29.2 R?#30.2
NetIC?#10_13: IC?#10.13(IN-D) IC?#10.14(OUTD)
NetIC?#11_1: IC?#11.1(OUTA) IC?#11.2(IN-A)
NetIC?#11_3: IC?#11.3(In+A) R?#32.2 R?#33.2
NetIC?#13_5: IC?#13.5(In+B) R?#35.2 R?#36.2
NetIC?#13_6: IC?#13.6(IN-B) IC?#13.7(OUTB)
NetIC?#14_8: IC?#14.8(OUTC) IC?#14.9(IN-C)
NetIC?#14_10: IC?#14.10(In+C) R?#38.2 R?#39.2
NetIC?#15_12: IC?#15.12(In+D) R?#41.2 R?#42.2
NetIC?#15_13: IC?#15.13(IN-D) IC?#15.14(OUTD)

### Notes on the sheet
- (in symbol TSV914IDT, part A) +; -
- (in symbol TSV914IDT, part B) +; -
- (in symbol TSV914IDT, part C) +; -
- (in symbol TSV914IDT, part D) +; -

### Library data of the parts
C?#39-C?#48 = C: MPN: 06033C104KAT4A; Link: https://www.lcsc.com/product-detail/Multilayer-Ceramic-Capacitors-MLCC-SMD-SMT_Kyocera-AVX-06033C104KAT4A_C2167104.html
D?#3-D?#10 = SMF7.0A-TP: TVS Diode (Uni-directional); Manufacturer_Name: MCC; Manufacturer_Part_Number: FTR SMF7.0A; Datasheet Link: https://www.mccsemi.com/pdf/Products/SMF5.0-170(SOD-123FL).pdf; Height: 1.35mm; Arrow Part Number: SMF7.0A-TP; Arrow Price/Stock: https://www.arrow.com/en/products/smf7.0a-tp/micro-commercial-components; link: https://www.lcsc.com/product-detail/ESD-and-Surge-Protection-TVS-ESD_FTR-SMF7-0A_C707468.html
IC?#7-IC?#16 = TSV914IDT: Integrated Circuit; Manufacturer_Name: STMicroelectronics; Datasheet Link: http://www.st.com/st-web-ui/static/active/en/resource/technical/document/datasheet/CD00127596.pdf; Height: 1.75mm; Manufacturer_Part_Number: TSV914IDT; Mouser Part Number: 511-TSV914IDT; Mouser Price/Stock: https://www.mouser.co.uk/ProductDetail/STMicroelectronics/TSV914IDT?qs=5J552fbOmooMkhgQYeD%252Bdg%3D%3D; Arrow Part Number: TSV914IDT; Arrow Price/Stock: https://www.arrow.com/en/products/tsv914idt/stmicroelectronics

## Nets that join several sheets
5V: Sheet1 (R?#3.1), Sheet2 (IC?#5.1 IC?#5.3 IC?#6.3), Sheet3 (C?#44.2 C?#48.2 IC?#12.4 IC?#16.4)
NRST: Sheet1 (19 pins), Sheet2 (37 pins), Sheet3 (C?#44.1 C?#48.1 IC?#12.11 IC?#16.11)
VCC: Sheet1 (IC?#1.49), Sheet2 (27 pins)